# EAGLE schematic balanceador_arduino (EAGLE 7.6.0)
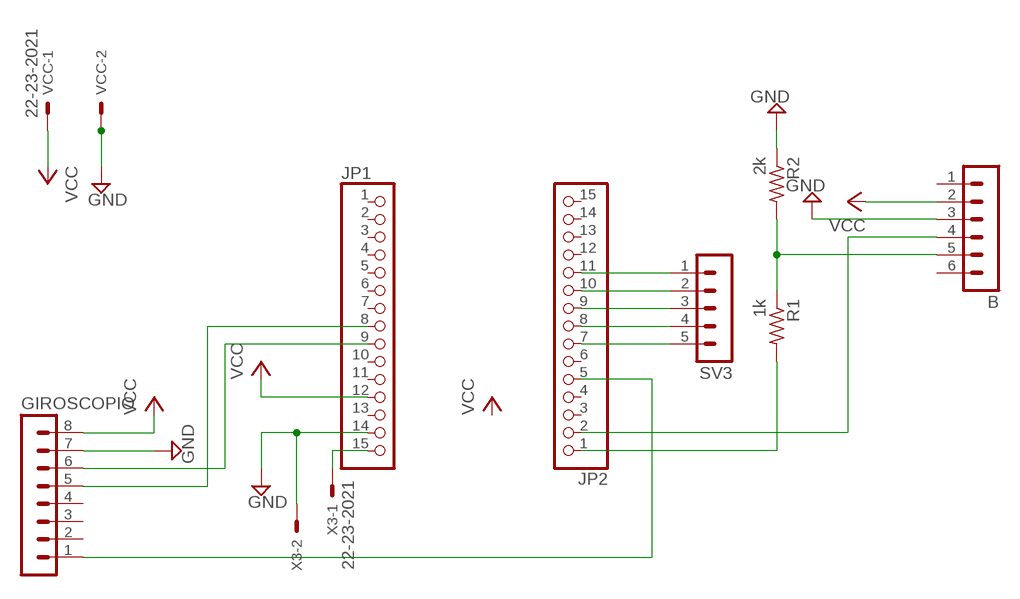
[diagram p0: schematic, sheet 1]

## Parts
B  MA06-1  [MA06-1]
GIROSCOPIO  MA08-1  [MA08-1]
JP1  PINHD-1X15  [1X15]
JP2  PINHD-1X15  [1X15]
R1  1k  R-US_0204/7  [0204/7]
R2  2k  R-US_0204/7  [0204/7]
SV3  MA05-1  [MA05-1]
VCC  22-23-2021  [22-23-2021]
X3  22-23-2021  [22-23-2021]

## Nets
D4: JP2.7 SV3.5
GND: B.3 GIROSCOPIO.7 JP1.14 R2.1 VCC.2 X3.2
N$1: B.5 R1.1 R2.2
N$2: GIROSCOPIO.6 JP1.9
N$3: GIROSCOPIO.5 JP1.8
N$4: JP2.1 R1.2
N$5: B.4 JP2.2
N$6: GIROSCOPIO.1 JP2.5
N$8: JP2.8 SV3.4
N$9: JP2.9 SV3.3
N$10: JP2.10 SV3.2
N$11: JP2.11 SV3.1
N$12: JP1.15 X3.1
VCC: B.2 GIROSCOPIO.8 JP1.12 VCC.1
Unconnected: B.1 B.6 GIROSCOPIO.2 GIROSCOPIO.3 GIROSCOPIO.4 JP1.1 JP1.2 JP1.3 JP1.4 JP1.5 JP1.6 JP1.7 JP1.10 JP1.11 JP1.13 JP2.3 JP2.4 JP2.6 JP2.12 JP2.13 JP2.14 JP2.15

## Library data of the parts
B = con-lstb:MA06-1: PIN HEADER; OC_FARNELL: unknown; OC_NEWARK: unknown
GIROSCOPIO = con-lstb:MA08-1: PIN HEADER; OC_FARNELL: unknown; OC_NEWARK: unknown
JP1 JP2 = pinhead:PINHD-1X15: PIN HEADER
R1 R2 = resistor:R-US_: RESISTOR, American symbol
SV3 = con-lstb:MA05-1: PIN HEADER; OC_FARNELL: unknown; OC_NEWARK: unknown
VCC X3 = con-molex:22-23-2021: .100" (2.54mm) Center Header - 2 Pin; MF: MOLEX; MPN: 22-23-2021; OC_FARNELL: 1462926; OC_NEWARK: 25C3832